# Altium project zxevo.PrjPcb (part 2 of 2)

## Sheet COM.SchDoc
size A4
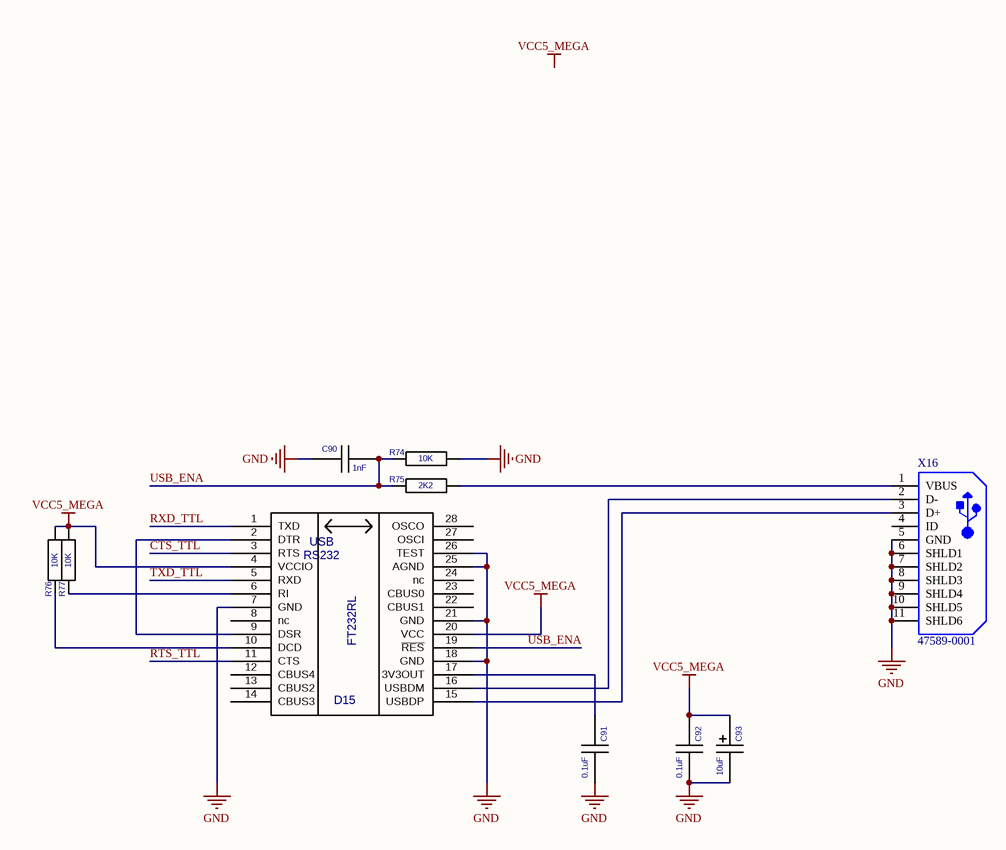
[diagram p12: COM.SchDoc]

### Parts
C90  value 1nF  [C-CHIP]  (hidden comment: CAPCHIP)
C91  value 0.1uF  [C-CHIP]  (hidden comment: CAPCHIP)
C92  value 0.1uF  [C-CHIP]  (hidden comment: CAPCHIP)
C93  value 10uF  [EC-CHIP]  (hidden comment: ECAPCHIP)
D15  FT232RL  [SSOP28]
R74  value 10K  [R-CHIP]  (hidden comment: RESCHIP)
R75  value 2K2  [R-CHIP]  (hidden comment: RESCHIP)
R76  value 10K  [R-CHIP]  (hidden comment: RESCHIP)
R77  value 10K  [R-CHIP]  (hidden comment: RESCHIP)
X16  47589-0001  [MOLX-47589-0001_V]

### Nets
GND: C90.1 C91.2 C92.2 C93.2 D15.7(GND) D15.18(GND) D15.21(GND) D15.25(AGND) D15.26(TEST) R74.1(i/o) X16.5(GND) X16.6(SHLD1) X16.7(SHLD2) X16.8(SHLD3) X16.9(SHLD4) X16.10(SHLD5) X16.11(SHLD6)
VCC5_MEGA: C92.1 C93.1 D15.4(VCCIO) D15.20(VCC) R76.1(i/o) R77.1(i/o)
CTS_TTL: D15.3(RTS)
RTS_TTL: D15.11(CTS)
RXD_TTL: D15.1(TXD)
TXD_TTL: D15.5(RXD)
USB_ENA: C90.2 D15.19(~{RES}) R74.2(i/o1) R75.2(i/o1)
NetC91_1: C91.1 D15.17(3V3OUT)
NetD15_2: D15.2(DTR) D15.9(DSR)
NetD15_6: D15.6(RI) R77.2(i/o1)
NetD15_10: D15.10(DCD) R76.2(i/o1)
NetD15_15: D15.15(USBDP) X16.3(D+)
NetD15_16: D15.16(USBDM) X16.2(D-)
NetR75_1: R75.1(i/o) X16.1(VBUS)

Not connected (* = marked no-connect by the designer): D15 8(nc) 12(CBUS4) 13(CBUS2) 14(CBUS3) 22(CBUS1) 23(CBUS0) 24(nc) 27(OSCI) 28(OSCO); X16 4(ID)

### Notes on the sheet
- Labels drawn without touching a wire or pin: VCC5_MEGA
- (in symbol FT232RL) USB; RS232

### Library data of the parts
X16 = CMP-2000-05610-1: Right Angle Female Type AB Micro USB Connector, 30 V, 1.8 A, -30 to 85 degC, RoHS, Tape and Reel; Number of Ports: 1Port; Current Rating: 1.8A; Brand: Molex; Connector Type: MicroUSBTypeABreceptacle; Number of Contacts: 5Contact; Voltage Rating: 30VAC; Color: Black; Product: MicroUSBTypeABConnectors; Package URL: http://www.molex.com/pdm_docs/sd/475890001_sd.pdf; Contact Plating: Gold; Datasheet URL: http://www.molex.com/webdocs/datasheets/pdf/en-us/0475890001_IO_CONNECTORS.pdf; Operating Temperature Range: -20Cto+85C; Termination Style: SMD/SMT; Mounting Angle: Right; Package Reference: 47589-0001; Gender: Female; Package Description: Micro USB Connector, Pitch 0.65 mm, 5 Positions, Body 7.5 x 5.6 mm; Mounting Technology: SurfaceMount; Contact Material: CopperAlloy; Packaging: Reel; RoHS: True; Standard: USB; Manufacturer URL: http://www.molex.com/; Manufacturer: Molex; Datasheet Version: 12/2016; Product Category: USBConnectors; Series: 47589
D15 = FT232RL: Value: *

## Sheet BUS.SchDoc
size A4
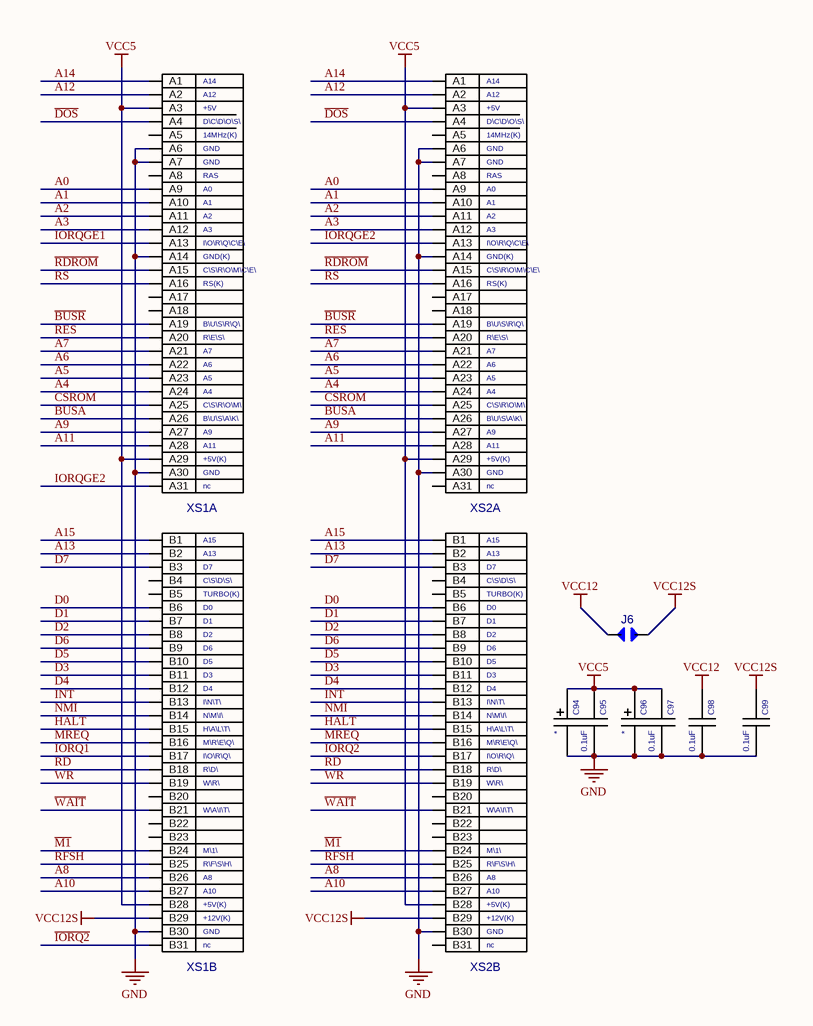
[diagram p13: BUS.SchDoc]

### Parts
C94  ECAPCHIPB  [EC-CHIPB]  (value not drawn)
C95  value 0.1uF  [C-CHIP]  (hidden comment: CAPCHIP)
C96  ECAPCHIPB  [EC-CHIPB]  (value not drawn)
C97  value 0.1uF  [C-CHIP]  (hidden comment: CAPCHIP)
C98  value 0.1uF  [C-CHIP]  (hidden comment: CAPCHIP)
C99  value 0.1uF  [C-CHIP]  (hidden comment: CAPCHIP)
J6  JUMPER  [JUMPER]  (value not drawn)
XS1  ZXSLOT  [SLOT62]  (value not drawn)  (parts A,B of 2)
XS2  ZXSLOT  [SLOT62]  (value not drawn)  (parts A,B of 2)

### Nets
GND: C94.2 C95.2 C96.2 C97.2 C98.2 C99.2 XS1.A6 XS1.A7 XS1.A14 XS1.A30 XS1.B30 XS2.A6 XS2.A7 XS2.A14 XS2.A30 XS2.B30
VCC5: C94.1 C95.1 C96.1 C97.1 XS1.A3 XS1.A29 XS1.B28 XS2.A3 XS2.A29 XS2.B28
VCC12: C98.1 J6.0
VCC12S: C99.1 J6.1 XS1.B29 XS2.B29
A0: XS1.A9 XS2.A9
A1: XS1.A10 XS2.A10
A2: XS1.A11 XS2.A11
A3: XS1.A12 XS2.A12
A4: XS1.A24 XS2.A24
A5: XS1.A23 XS2.A23
A6: XS1.A22 XS2.A22
A7: XS1.A21 XS2.A21
A8: XS1.B26 XS2.B26
A9: XS1.A27 XS2.A27
A10: XS1.B27 XS2.B27
A11: XS1.A28 XS2.A28
A12: XS1.A2 XS2.A2
A13: XS1.B2 XS2.B2
A14: XS1.A1 XS2.A1
A15: XS1.B1 XS2.B1
~{BUSA}: XS1.A26 XS2.A26
~{BUSR}: XS1.A19 XS2.A19
~{CSROM}: XS1.A25 XS2.A25
D0: XS1.B6 XS2.B6
D1: XS1.B7 XS2.B7
D2: XS1.B8 XS2.B8
D3: XS1.B11 XS2.B11
D4: XS1.B12 XS2.B12
D5: XS1.B10 XS2.B10
D6: XS1.B9 XS2.B9
D7: XS1.B3 XS2.B3
~{DOS}: XS1.A4 XS2.A4
~{HALT}: XS1.B15 XS2.B15
~{INT}: XS1.B13 XS2.B13
~{IORQ1}: XS1.B17
~{IORQ2}: XS1.B31 XS2.B17
IORQGE1: XS1.A13
IORQGE2: XS1.A31 XS2.A13
~{M1}: XS1.B24 XS2.B24
~{MREQ}: XS1.B16 XS2.B16
~{NMI}: XS1.B14 XS2.B14
~{RD}: XS1.B18 XS2.B18
~{RDROM}: XS1.A15 XS2.A15
~{RES}: XS1.A20 XS2.A20
~{RFSH}: XS1.B25 XS2.B25
RS: XS1.A16 XS2.A16
~{WAIT}: XS1.B21 XS2.B21
~{WR}: XS1.B19 XS2.B19

Not connected (* = marked no-connect by the designer): XS1 A5 A8 A17 A18 B4 B5 B20 B22 B23; XS2 A5 A8 A17 A18 A31 B4 B5 B20 B22 B23 B31

### Notes on the sheet
- (in symbol ZXSLOT, part A) +5V; D\C\D\O\S\; 14MHz(K); GND; RAS; A0; I\O\R\Q\C\E\; GND(K); C\S\R\O\M\C\E\; RS(K); B\U\S\R\Q\; R\E\S\; C\S\R\O\M\; B\U\S\A\K\; +5V(K); nc
- (in symbol ZXSLOT, part B) D7; C\S\D\S\; TURBO(K); D0; D1; D2; D6; D5; D3; D4; I\N\T\; N\M\I\; H\A\L\T\; M\R\E\Q\; I\O\R\Q\; R\D\; W\R\; W\A\I\T\; M\1\; R\F\S\H\; +5V(K); +12V(K); GND; nc

### Library data of the parts
J6 = JUMPER: 12V enabled; Value: *
C94 C96 = ECAPCHIPB: Value: *
XS1 XS2 = ZXSLOT: Value: *

## Sheet CPU ROM.SchDoc
size A4
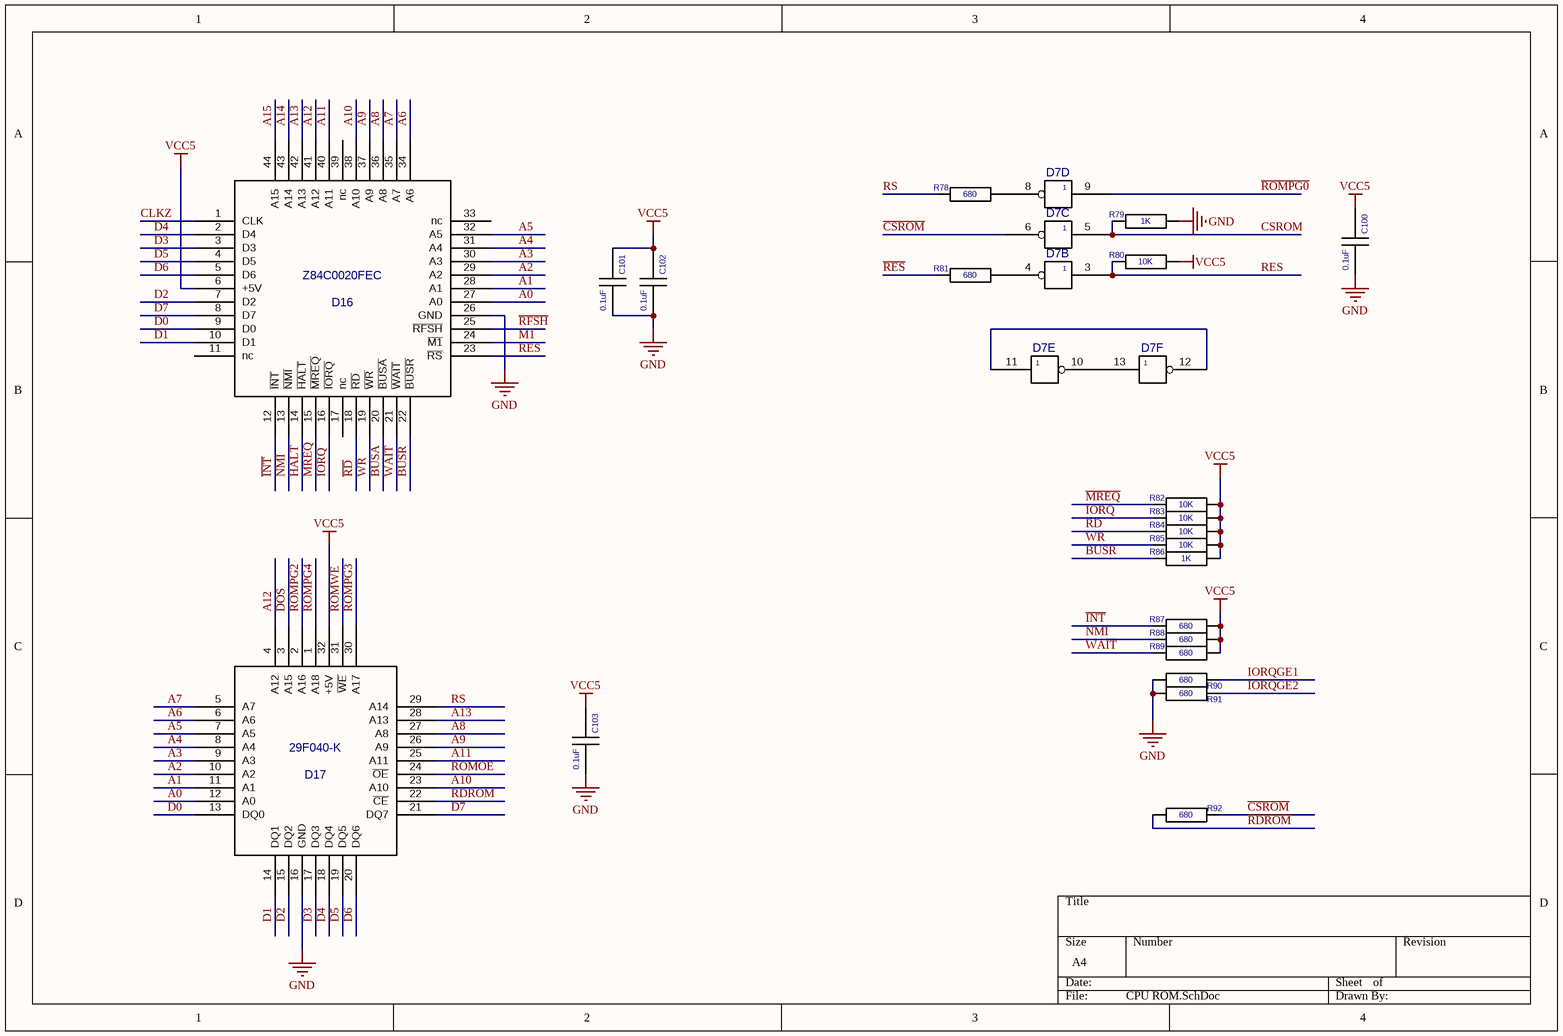
[diagram p14: CPU ROM.SchDoc]

### Parts
C100  value 0.1uF  [C-CHIP]  (hidden comment: CAPCHIP)
C101  value 0.1uF  [C-CHIP]  (hidden comment: CAPCHIP)
C102  value 0.1uF  [C-CHIP]  (hidden comment: CAPCHIP)
C103  value 0.1uF  [C-CHIP]  (hidden comment: CAPCHIP)
D7  04  [SO14]  (value not drawn)  (parts B,C,D,E,F of 6)
D16  Z84C0020FEC  [QFP44X8]
D17  29F040-K  [PLCC32]
R78  value 680  [R-CHIP]  (hidden comment: RESCHIP)
R79  value 1K  [R-CHIP]  (hidden comment: RESCHIP)
R80  value 10K  [R-CHIP]  (hidden comment: RESCHIP)
R81  value 680  [R-CHIP]  (hidden comment: RESCHIP)
R82  value 10K  [R-CHIP]  (hidden comment: RESCHIP)
R83  value 10K  [R-CHIP]  (hidden comment: RESCHIP)
R84  value 10K  [R-CHIP]  (hidden comment: RESCHIP)
R85  value 10K  [R-CHIP]  (hidden comment: RESCHIP)
R86  value 1K  [R-CHIP]  (hidden comment: RESCHIP)
R87  value 680  [R-CHIP]  (hidden comment: RESCHIP)
R88  value 680  [R-CHIP]  (hidden comment: RESCHIP)
R89  value 680  [R-CHIP]  (hidden comment: RESCHIP)
R90  value 680  [R-CHIP]  (hidden comment: RESCHIP)
R91  value 680  [R-CHIP]  (hidden comment: RESCHIP)
R92  value 680  [R-CHIP]  (hidden comment: RESCHIP)

### Nets
GND: C100.2 C101.2 C102.2 C103.2 D7.7(GND) D16.26(GND) D17.16(GND) R79.1(i/o) R90.1(i/o) R91.1(i/o)
VCC5: C100.1 C101.1 C102.1 C103.1 D7.14(+5v) D16.6(+5V) D17.32(+5V) R80.1(i/o) R82.1(i/o) R83.1(i/o) R84.1(i/o) R85.1(i/o) R86.1(i/o) R87.1(i/o) R88.1(i/o) R89.1(i/o)
A0: D16.27(A0) D17.12(A0)
A1: D16.28(A1) D17.11(A1)
A2: D16.29(A2) D17.10(A2)
A3: D16.30(A3) D17.9(A3)
A4: D16.31(A4) D17.8(A4)
A5: D16.32(A5) D17.7(A5)
A6: D16.34(A6) D17.6(A6)
A7: D16.35(A7) D17.5(A7)
A8: D16.36(A8) D17.27(A8)
A9: D16.37(A9) D17.26(A9)
A10: D16.38(A10) D17.23(A10)
A11: D16.40(A11) D17.25(A11)
A12: D16.41(A12) D17.4(A12)
A13: D16.42(A13) D17.28(A13)
A14: D16.43(A14)
A15: D16.44(A15)
~{BUSA}: D16.20(~{BUSA})
~{BUSR}: D16.22(~{BUSR}) R86.2(i/o1)
~{CSROM}: D7.6 R92.2(i/o1)
CLKZ: D16.1(CLK)
CSROM: D7.5 R79.2(i/o1)
D0: D16.9(D0) D17.13(DQ0)
D1: D16.10(D1) D17.14(DQ1)
D2: D16.7(D2) D17.15(DQ2)
D3: D16.3(D3) D17.17(DQ3)
D4: D16.2(D4) D17.18(DQ4)
D5: D16.4(D5) D17.19(DQ5)
D6: D16.5(D6) D17.20(DQ6)
D7: D16.8(D7) D17.21(DQ7)
~{DOS}: D17.3(A15)
~{HALT}: D16.14(~{HALT})
~{INT}: D16.12(~{INT}) R87.2(i/o1)
~{IORQ}: D16.16(~{IORQ}) R83.2(i/o1)
IORQGE1: R90.2(i/o1)
IORQGE2: R91.2(i/o1)
~{M1}: D16.24(~{M1})
~{MREQ}: D16.15(~{MREQ}) R82.2(i/o1)
~{NMI}: D16.13(~{NMI}) R88.2(i/o1)
~{RD}: D16.18(~{RD}) R84.2(i/o1)
~{RDROM}: D17.22(~{CE}) R92.1(i/o)
~{RES}: D16.23(~{RS}) R81.2(i/o1)
~{RFSH}: D16.25(~{RFSH})
~{ROMOE}: D17.24(~{OE})
~{ROMPG0}: D7.9
~{ROMWE}: D17.31(~{WE})
RES: D7.3 R80.2(i/o1)
ROMPG2: D17.2(A16)
ROMPG3: D17.30(A17)
ROMPG4: D17.1(A18)
RS: D17.29(A14) R78.2(i/o1)
~{WAIT}: D16.21(~{WAIT}) R89.2(i/o1)
~{WR}: D16.19(~{WR}) R85.2(i/o1)
NetD7_4: D7.4 R81.1(i/o)
NetD7_8: D7.8 R78.1(i/o)
NetD7_10: D7.10 D7.13
NetD7_11: D7.11 D7.12

Not connected (* = marked no-connect by the designer): D16 11(nc) 17(nc) 33(nc) 39(nc)

### Library data of the parts
D7 = 04: Value: 74ACT04
D16 = Z84C0020FEC: Value: *
D17 = 29F040-K: Value: *

## Nets that join several sheets
AGND: Tape (D9.7), AY Amp (D9.7)
AVCC5: Tape (C32.1 D9.14), AY Amp (5 pins), FPGA (R25.1)
GND: First_Sheet (7 pins), Sheet1 (11 pins), Tape (9 pins), AY Amp (37 pins), Video out (41 pins), Power ATX (28 pins), RTC (8 pins), FPGA (30 pins), MCU (29 pins), FDC (28 pins), Memory (16 pins), COM (17 pins), BUS (16 pins), CPU ROM (10 pins)
VCC2V5: Power ATX (8 pins), FPGA (12 pins)
VCC3V3: First_Sheet (R2.2 R3.2 X1.4), Sheet1 (L1.1 R6.1 R7.1 R8.1), AY Amp (C48.1 C50.2 L2.1), Video out (24 pins), Power ATX (9 pins), FPGA (15 pins)
VCC5: Sheet1 (R4.2 R5.2), Power ATX (9 pins), FPGA (C10.1 D6.2 D6.7 D7.14), MCU (12 pins), FDC (18 pins), Memory (14 pins), BUS (10 pins), CPU ROM (16 pins)
VCC5_MEGA: First_Sheet (X2.4 X3.4 X3.7), RTC (R14.1 R15.1 R16.1 VD1.1), MCU (17 pins), COM (6 pins)
VCC5_STBY: Power ATX (C6.1 PWR1.9), MCU (VD5.1)
VCC12: Power ATX (C4.1 C5.1 PWR1.10), FDC (VD7.1), BUS (C98.1 J6.0)
A0: FPGA (D8.44), BUS (XS1.A9 XS2.A9), CPU ROM (D16.27 D17.12)
A1: FPGA (D8.41), BUS (XS1.A10 XS2.A10), CPU ROM (D16.28 D17.11)
A2: FPGA (D8.40), BUS (XS1.A11 XS2.A11), CPU ROM (D16.29 D17.10)
A3: FPGA (D8.39), BUS (XS1.A12 XS2.A12), CPU ROM (D16.30 D17.9)
A4: FPGA (D8.38), BUS (XS1.A24 XS2.A24), CPU ROM (D16.31 D17.8)
A5: FPGA (D8.37), FDC (D13.5), BUS (XS1.A23 XS2.A23), CPU ROM (D16.32 D17.7)
A6: FPGA (D8.36), FDC (D13.6), BUS (XS1.A22 XS2.A22), CPU ROM (D16.34 D17.6)
A7: FPGA (D8.31), BUS (XS1.A21 XS2.A21), CPU ROM (D16.35 D17.5)
A8: FPGA (D8.30), BUS (XS1.B26 XS2.B26), CPU ROM (D16.36 D17.27)
A9: FPGA (D8.29), BUS (XS1.A27 XS2.A27), CPU ROM (D16.37 D17.26)
A10: FPGA (D8.28), BUS (XS1.B27 XS2.B27), CPU ROM (D16.38 D17.23)
A11: FPGA (D8.27), BUS (XS1.A28 XS2.A28), CPU ROM (D16.40 D17.25)
A12: FPGA (D8.26), BUS (XS1.A2 XS2.A2), CPU ROM (D16.41 D17.4)
A13: FPGA (D8.25), BUS (XS1.B2 XS2.B2), CPU ROM (D16.42 D17.28)
A14: FPGA (D8.24), BUS (XS1.A1 XS2.A1), CPU ROM (D16.43)
A15: FPGA (D8.19), BUS (XS1.B1 XS2.B1), CPU ROM (D16.44)
ATX_POWERON: Power ATX (VT1.1), MCU (R49.1)
AY_BC1: AY Amp (D3.29), FPGA (D8.136)
AY_BDIR: AY Amp (D3.27), FPGA (D8.135)
AY_CLK: AY Amp (D3.22), FPGA (D8.134)
~{BEEP}: Tape (D9.2 D9.3), AY Amp (D9.5)
~{BUSA}: BUS (XS1.A26 XS2.A26), CPU ROM (D16.20)
~{BUSR}: BUS (XS1.A19 XS2.A19), CPU ROM (D16.22 R86.2)
BEEP: Tape (D9.1), FPGA (D8.133 R25.2)
~{CONFIG}: FPGA (D8.105), MCU (D10.61 R46.2)
~{CSROM}: BUS (XS1.A25 XS2.A25), CPU ROM (D7.6 R92.2)
CLKZ: FPGA (R22.1), CPU ROM (D16.1)
CONFDONE: FPGA (D8.2), MCU (D10.59 R48.2)
CSROM: FPGA (D8.150), CPU ROM (D7.5 R79.2)
CTS_TTL: MCU (D10.16), COM (D15.3)
D0: AY Amp (D3.37), FPGA (D8.18), FDC (D13.7), BUS (XS1.B6 XS2.B6), CPU ROM (D16.9 D17.13)
D1: AY Amp (D3.36), FPGA (D8.17), FDC (D13.8), BUS (XS1.B7 XS2.B7), CPU ROM (D16.10 D17.14)
D2: AY Amp (D3.35), FPGA (D8.16), FDC (D13.9), BUS (XS1.B8 XS2.B8), CPU ROM (D16.7 D17.15)
D3: AY Amp (D3.34), FPGA (D8.15), FDC (D13.10), BUS (XS1.B11 XS2.B11), CPU ROM (D16.3 D17.17)
D4: AY Amp (D3.33), FPGA (D8.14), FDC (D13.11), BUS (XS1.B12 XS2.B12), CPU ROM (D16.2 D17.18)
D5: AY Amp (D3.32), FPGA (D8.13), FDC (D13.12), BUS (XS1.B10 XS2.B10), CPU ROM (D16.4 D17.19)
D6: AY Amp (D3.31), FPGA (D8.12), FDC (D13.13), BUS (XS1.B9 XS2.B9), CPU ROM (D16.5 D17.20)
D7: AY Amp (D3.30), FPGA (D8.11), FDC (D13.14), BUS (XS1.B3 XS2.B3), CPU ROM (D16.8 D17.21)
~{DOS}: FPGA (D8.160), BUS (XS1.A4 XS2.A4), CPU ROM (D17.3)
~{HALT}: BUS (XS1.B15 XS2.B15), CPU ROM (D16.14)
~{IDE_CS1}: Video out (U3.49), FPGA (D8.112)
~{INT}: FPGA (D8.10), BUS (XS1.B13 XS2.B13), CPU ROM (D16.12 R87.2)
~{IORQ}: FPGA (D8.7), CPU ROM (D16.16 R83.2)
~{IORQ1}: FPGA (D8.148), BUS (XS1.B17)
~{IORQ2}: FPGA (D8.149), BUS (XS1.B31 XS2.B17)
IDE_A1: Video out (U2.24 U3.87), FPGA (D8.103)
IDE_A2: Video out (U3.50), FPGA (D8.111)
IDE_D0: Video out (U3.52), FPGA (D8.96)
IDE_D1: Video out (U3.55), FPGA (D8.94)
IDE_D2: Video out (U3.57), FPGA (D8.92)
IDE_D3: Video out (U3.60), FPGA (D8.89)
IDE_D4: Video out (U3.63), FPGA (D8.87)
IDE_D5: Video out (U3.67), FPGA (D8.85)
IDE_D6: Video out (U3.69), FPGA (D8.75)
IDE_D7: Video out (U3.71), FPGA (D8.73)
IDE_D8: Video out (U3.72), FPGA (D8.71)
IDE_D9: Video out (U3.70), FPGA (D8.74)
IDE_D10: Video out (U3.68), FPGA (D8.83)
IDE_D11: Video out (U3.64), FPGA (D8.86)
IDE_D12: Video out (U3.61), FPGA (D8.88)
IDE_D13: Video out (U3.58), FPGA (D8.90)
IDE_D14: Video out (U3.56), FPGA (D8.93)
IDE_D15: Video out (U3.54), FPGA (D8.95)
IORQGE1: FPGA (D8.78), BUS (XS1.A13), CPU ROM (R90.2)
IORQGE2: FPGA (D8.80), BUS (XS1.A31 XS2.A13), CPU ROM (R91.2)
~{M1}: FPGA (D8.144), BUS (XS1.B24 XS2.B24), CPU ROM (D16.24)
~{MREQ}: FPGA (D8.8), BUS (XS1.B16 XS2.B16), CPU ROM (D16.15 R82.2)
~{NMI}: FPGA (D8.9), BUS (XS1.B14 XS2.B14), CPU ROM (D16.13 R88.2)
~{PRGRST}: First_Sheet (X2.5 X3.6), MCU (C74.2 D10.20 R61.1 VT2.3)
PLLS0: FPGA (D6.6), MCU (D10.4)
PLLS1: FPGA (D6.4), MCU (D10.5)
PRGDI: First_Sheet (X2.9), MCU (D10.2 R56.2)
PRGDO: First_Sheet (X2.3), MCU (D10.3)
PRGEXCLOCK: First_Sheet (X2.8), MCU (J3.1)
PWRGOOD: Power ATX (PWR1.8), MCU (R59.1)
~{RD}: FPGA (D8.141), FDC (D13.4), BUS (XS1.B18 XS2.B18), CPU ROM (D16.18 R84.2)
~{RDAT_B}: FPGA (D8.68), FDC (D11.10 R68.1)
~{RDROM}: BUS (XS1.A15 XS2.A15), CPU ROM (D17.22 R92.1)
~{RES}: AY Amp (D3.23), BUS (XS1.A20 XS2.A20), CPU ROM (D16.23 R81.2)
~{RFSH}: FPGA (D8.147), BUS (XS1.B25 XS2.B25), CPU ROM (D16.25)
~{RLCAS}: FPGA (R18.1), Memory (RAM1.31 RAM2.31)
~{ROMOE}: FPGA (D8.167), CPU ROM (D17.24)
~{ROMPG0}: FPGA (D8.161), CPU ROM (D7.9)
~{ROMWE}: FPGA (D8.166), CPU ROM (D17.31)
~{RRAS0}: FPGA (R17.1), Memory (RAM1.14)
~{RRAS1}: FPGA (R21.1), Memory (RAM2.14)
~{RTCINT}: RTC (D4.7 D5.7 R16.2), MCU (D10.9)
~{RUCAS}: FPGA (R19.1), Memory (RAM1.30 RAM2.30)
~{RWE}: FPGA (D8.187), Memory (RAM1.13 RAM2.13)
RA0: FPGA (D8.177), Memory (RAM1.17 RAM2.17)
RA1: FPGA (D8.175), Memory (RAM1.18 RAM2.18)
RA2: FPGA (D8.173), Memory (RAM1.19 RAM2.19)
RA3: FPGA (D8.170), Memory (RAM1.20 RAM2.20)
RA4: FPGA (D8.169), Memory (RAM1.23 RAM2.23)
RA5: FPGA (D8.172), Memory (RAM1.24 RAM2.24)
RA6: FPGA (D8.174), Memory (RAM1.25 RAM2.25)
RA7: FPGA (D8.176), Memory (RAM1.26 RAM2.26)
RA8: FPGA (D8.179), Memory (RAM1.27 RAM2.27)
RA9: FPGA (D8.180), Memory (RAM1.28 RAM2.28)
RD0: FPGA (D8.208), Memory (RAM1.2 RAM2.2)
RD1: FPGA (D8.206), Memory (RAM1.3 RAM2.3)
RD2: FPGA (D8.204), Memory (RAM1.4 RAM2.4)
RD3: FPGA (D8.202), Memory (RAM1.5 RAM2.5)
RD4: FPGA (D8.199), Memory (RAM1.7 RAM2.7)
RD5: FPGA (D8.197), Memory (RAM1.8 RAM2.8)
RD6: FPGA (D8.195), Memory (RAM1.9 RAM2.9)
RD7: FPGA (D8.192), Memory (RAM1.10 RAM2.10)
RD8: FPGA (D8.191), Memory (RAM1.33 RAM2.33)
RD9: FPGA (D8.193), Memory (RAM1.34 RAM2.34)
RD10: FPGA (D8.196), Memory (RAM1.35 RAM2.35)
RD11: FPGA (D8.198), Memory (RAM1.36 RAM2.36)
RD12: FPGA (D8.200), Memory (RAM1.38 RAM2.38)
RD13: FPGA (D8.203), Memory (RAM1.39 RAM2.39)
RD14: FPGA (D8.205), Memory (RAM1.40 RAM2.40)
RD15: FPGA (D8.207), Memory (RAM1.41 RAM2.41)
RES: FPGA (D8.142), CPU ROM (D7.3 R80.2)
ROMPG2: FPGA (D8.164), CPU ROM (D17.2)
ROMPG3: FPGA (D8.163), CPU ROM (D17.30)
ROMPG4: FPGA (D8.162), CPU ROM (D17.1)
RS: BUS (XS1.A16 XS2.A16), CPU ROM (D17.29 R78.2)
RTS_TTL: MCU (D10.30), COM (D15.11)
RXD_TTL: MCU (D10.27), COM (D15.1)
~{SDCS}: Sheet1 (XSD1.1 XSD2.1), FPGA (D8.119)
~{SPICS}: FPGA (D8.182), MCU (D10.10)
~{SPIINT}: FPGA (D8.159), MCU (D10.8)
~{STATUS}: FPGA (D8.52), MCU (D10.60 R47.2)
SCL: RTC (D4.6 D5.6 R15.2), MCU (D10.25)
SDA: RTC (D4.5 D5.5 R14.2), MCU (D10.26)
SDCLK: Sheet1 (XSD1.5 XSD2.5), FPGA (R26.1)
SDDET: Sheet1 (R5.1 XSD1.11 XSD2.11), MCU (D10.15)
SDDI: Sheet1 (R6.2 XSD1.7 XSD2.7), FPGA (D8.115)
SDDO: Sheet1 (XSD1.2 XSD2.2), FPGA (D8.116)
SDWPR: Sheet1 (R4.1 XSD1.12 XSD2.10), MCU (D10.14)
SPICK: First_Sheet (X2.1), FPGA (D8.155 D8.184), MCU (D10.11 R51.2)
SPIDI: FPGA (D8.158), MCU (D10.13)
SPIDO: FPGA (D8.156 D8.157), MCU (D10.12)
STEP: FPGA (D8.46), FDC (D12.5 D13.15)
TAPE_BIT: Tape (D9.8), MCU (D10.29)
TCK_AVR: First_Sheet (X3.1), MCU (D10.57)
TCK_FPGA: First_Sheet (R1.1 X1.1), FPGA (D8.1)
TDI_AVR: First_Sheet (X3.9), MCU (D10.54)
TDI_FPGA: First_Sheet (R3.1 X1.9), FPGA (D8.153)
TDO_AVR: First_Sheet (X3.3), MCU (D10.55)
TDO_FPGA: First_Sheet (X1.3), FPGA (D8.4)
TMS_AVR: First_Sheet (X3.5), MCU (D10.56)
TMS_FPGA: First_Sheet (R2.1 X1.5), FPGA (D8.50)
TXD_TTL: MCU (D10.28), COM (D15.5)
~{VG_CS}: FPGA (D8.45), FDC (D13.3 R64.1)
~{VG_RES}: FPGA (D8.54), FDC (D13.19 D14.3 R73.1)
VG_A0: FPGA (D8.69), FDC (D14.1)
VG_A1: FPGA (D8.70), FDC (D14.2)
VG_CLK: FPGA (D8.56), FDC (D13.24)
VG_DRQ: FPGA (D8.63), FDC (D13.38 R66.1)
VG_HRDY: FPGA (D8.55), FDC (D11.13 D13.23)
VG_IRQ: FPGA (D8.64), FDC (D13.39 R67.1)
VG_RAWR: FPGA (D8.58), FDC (D13.27)
VG_RCLK: FPGA (D8.57), FDC (D13.26)
VG_SIDE: FPGA (D8.65), FDC (D12.11)
VG_SL: FPGA (D8.47), FDC (D13.17)
VG_SR: FPGA (D8.53), FDC (D13.18)
VG_TR43: FPGA (D8.60), FDC (D13.29)
VG_WD: FPGA (D8.61), FDC (D13.31)
VG_WF_DE: FPGA (D8.62), FDC (D13.33 R65.1)
VG_WRD: FPGA (D8.67), FDC (D12.9)
~{WAIT}: FPGA (D8.143), BUS (XS1.B21 XS2.B21), CPU ROM (D16.21 R89.2)
~{WR}: FPGA (D8.140), FDC (D13.2), BUS (XS1.B19 XS2.B19), CPU ROM (D16.19 R85.2)